# EasyEDA Pro project Motor.eprj

# Schematic Schematic1
Board Name: Board1; Create Date: 2025-05-12; Page Name: P1; Project Name: Motor; Schematic Name: Schematic1; Update Date: 2025-05-25; Company: 嘉立创EDA; Page Size: A4; Version: V1.0
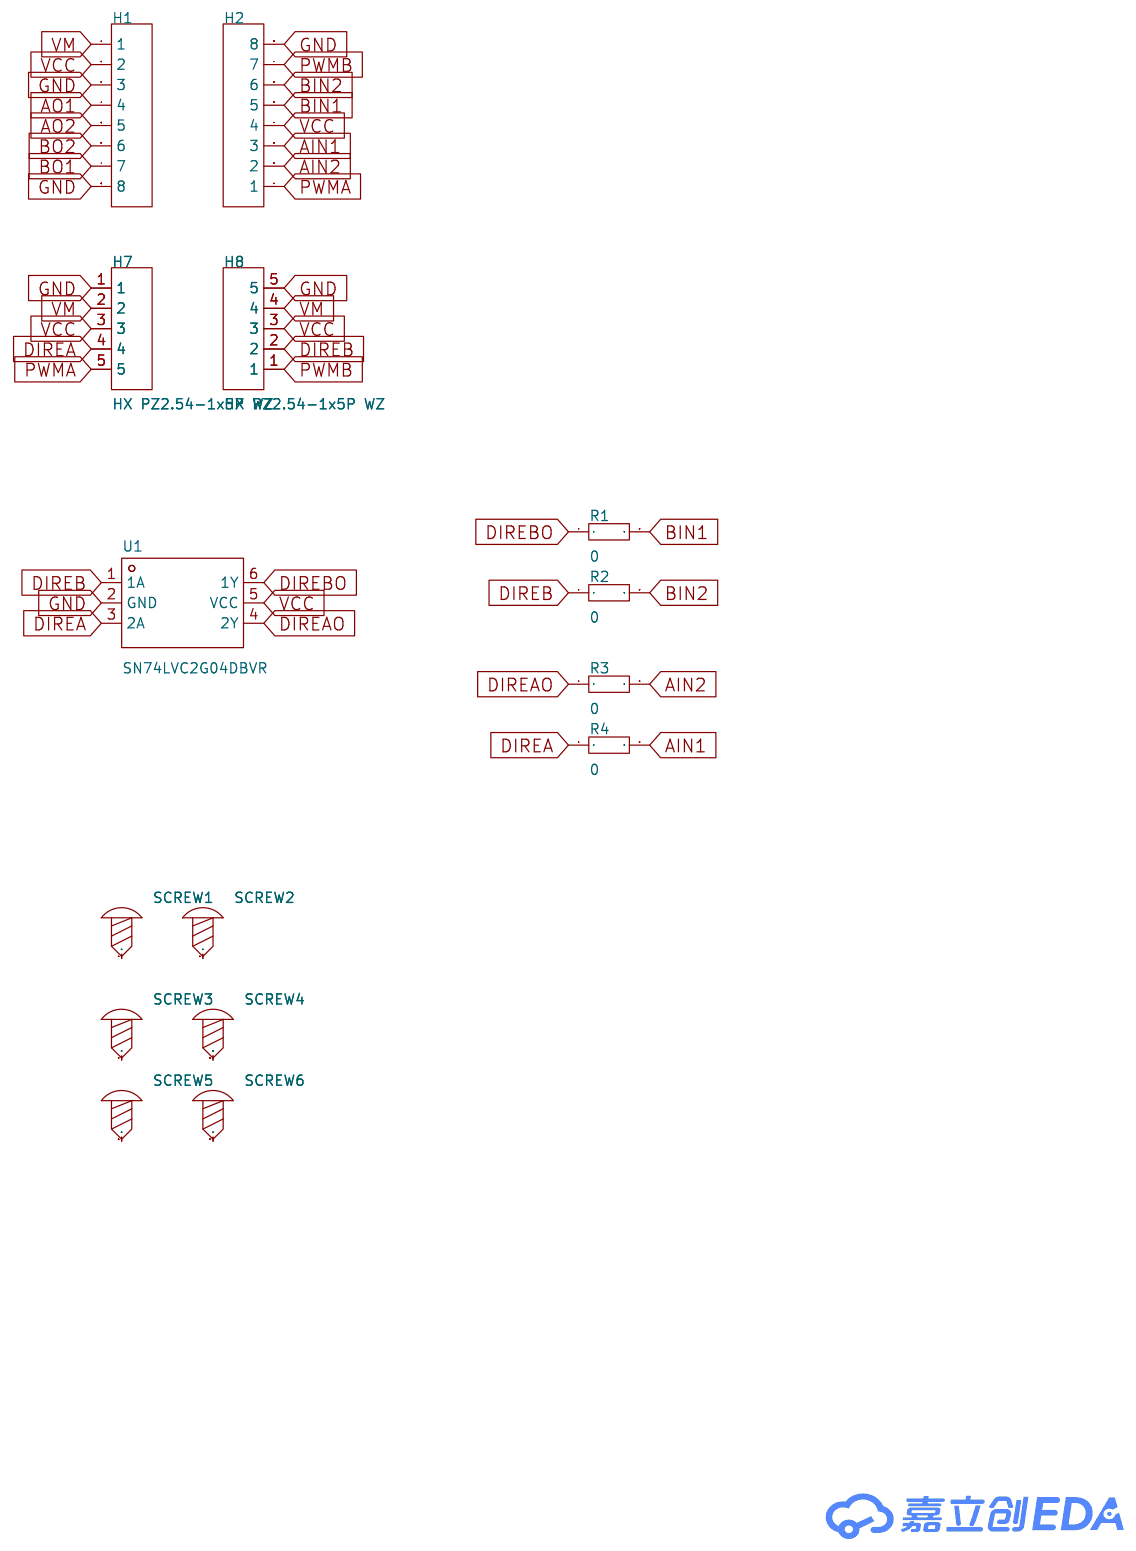
[diagram p0: schematic sheet]

## Parts
H1  -  [HDR-TH_8P-P2.54-V-F-1]
H2  -  [HDR-TH_8P-P2.54-V-F-1]
H7  HX PZ2.54-1x5P WZ  [HDR-TH_5P-P2.54-H-M-W10.0-N]
H8  HX PZ2.54-1x5P WZ  [HDR-TH_5P-P2.54-H-M-W10.0-N]
R1  0  [R0805]
R2  0  [R0805]
R3  0  [R0805]
R4  0  [R0805]
SCREW1  -  [M3螺丝]
SCREW2  -  [M3螺丝]
SCREW3  -  [M2螺丝]
SCREW4  -  [M2螺丝]
SCREW5  -  [M2螺丝]
SCREW6  -  [M2螺丝]
U1  SN74LVC2G04DBVR  [SOT-23-6_L2.9-W1.6-P0.95-LS2.8-BR]

## Library data of the parts
H1 H2 = HDR-F_2.54_1x8P: Supplier Part: C27438; Supplier Footprint: 插件
H7 H8 = HX PZ2.54-1x5P WZ: LCSC Part Name: 1x5P 间距:2.54mm 方针 弯插; Supplier Part: C32713264; Manufacturer: hanxia(韩下); Supplier Footprint: 弯插,P=2.54mm; Datasheet: https://atta.szlcsc.com/upload/public/pdf/source/20240723/1F79D9A8CAFAE1F1D766CA38C1092C29.pdf; Supplier: LCSC; Pin Structure: 1x5P; Pitch: 2.54mm; Circluar Pins/Square Pins: 方针; Mounting Type: 弯插; Number of Rows: 单排; Number of Pins: 5P; Current Rating: 3A; Length of Mating Pin: 6mm; Insulation Height: 2.5mm; Length of End Connection Pin: 3mm; Contact Material: 黄铜; Contact Plating: 金; Operating Temperature: -40℃~+105℃; Color: 黑色
R1-R4 = Res_0805: Supplier Footprint: 0805
SCREW1 SCREW2 = M3螺丝: Supplier Footprint: 插件
SCREW3-SCREW6 = M2螺丝: Supplier Footprint: 插件
U1 = SN74LVC2G04DBVR: LCSC Part Name: 双路反相器; Supplier Part: C10428; Manufacturer: TI(德州仪器); Supplier Footprint: SOT-23-6; JLCPCB Part Class: 扩展库; Datasheet: https://www.ti.com/cn/lit/gpn/sn74lvc2g04; Supplier: LCSC; Voltage - Supply: 1.65V~5.5V; Current - Supply: 10uA; Number of Circuits: 2; Number of Inputs: 2; Current - Output Low(IOL): 32mA; Current - Output High(IOH): 32mA; Input Logic Level - High: 1.7V~2V; Input Logic Level -Low: 700mV~800mV; Max Propagation Delay: 3.2ns@5V,50pF; Series: 74LVC系列

## Nets
GND: H1.3 H1.8 H2.8 H7.1 H8.5 U1.2(GND)
VCC: H1.2 H2.4 H7.3 H8.3 U1.5(VCC)
AIN1: H2.3 R4.2
AIN2: H2.2 R3.2
AO1: H1.4
AO2: H1.5
BIN1: H2.5 R1.2
BIN2: H2.6 R2.2
BO1: H1.7
BO2: H1.6
DIREA: H7.4 R4.1 U1.3(2A)
DIREAO: R3.1 U1.4(2Y)
DIREB: H8.2 R2.1 U1.1(1A)
DIREBO: R1.1 U1.6(1Y)
PWMA: H2.1 H7.5
PWMB: H2.7 H8.1
VM: H1.1 H7.2 H8.4

Not connected (* = marked no-connect by the designer): SCREW1 1; SCREW2 1; SCREW3 1; SCREW4 1; SCREW5 1; SCREW6 1

# Board PCB1
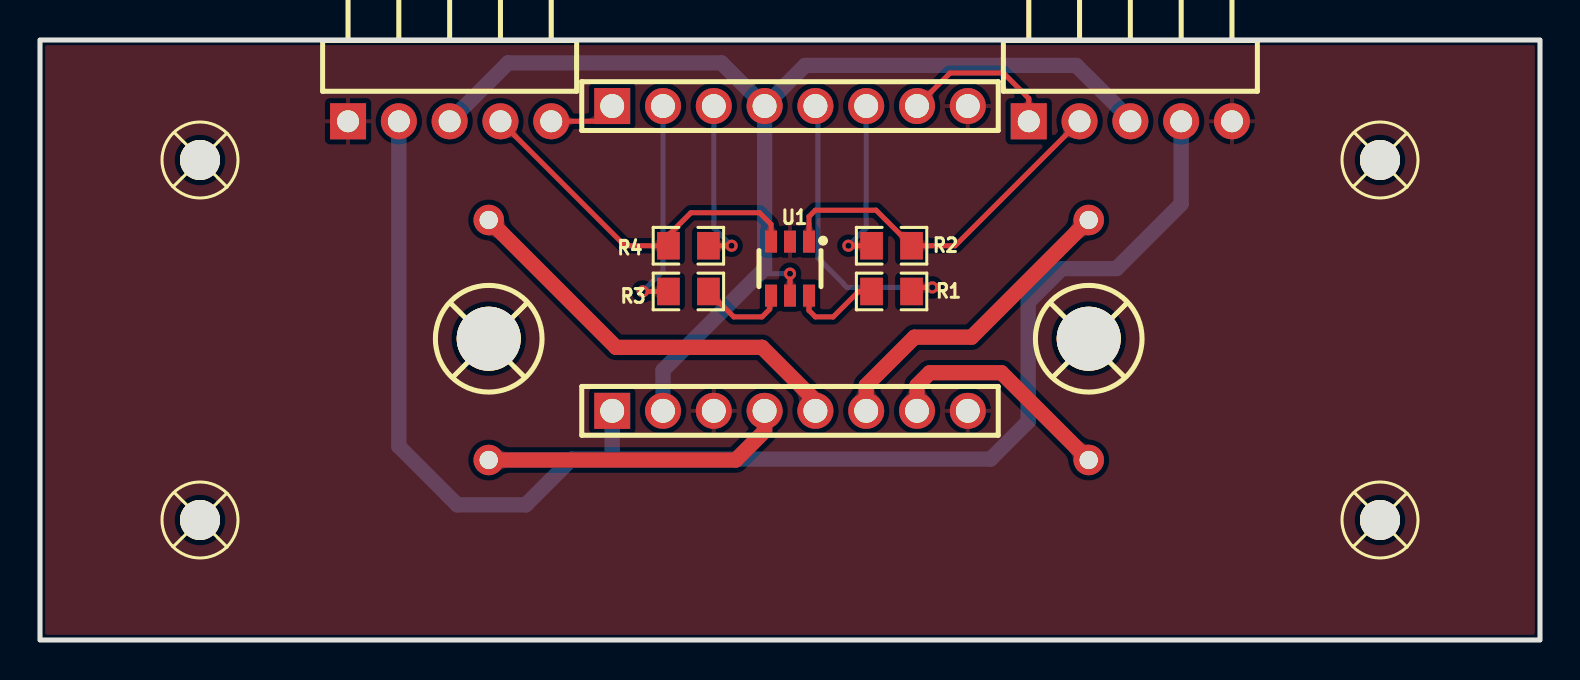
[diagram p1: board, top side]
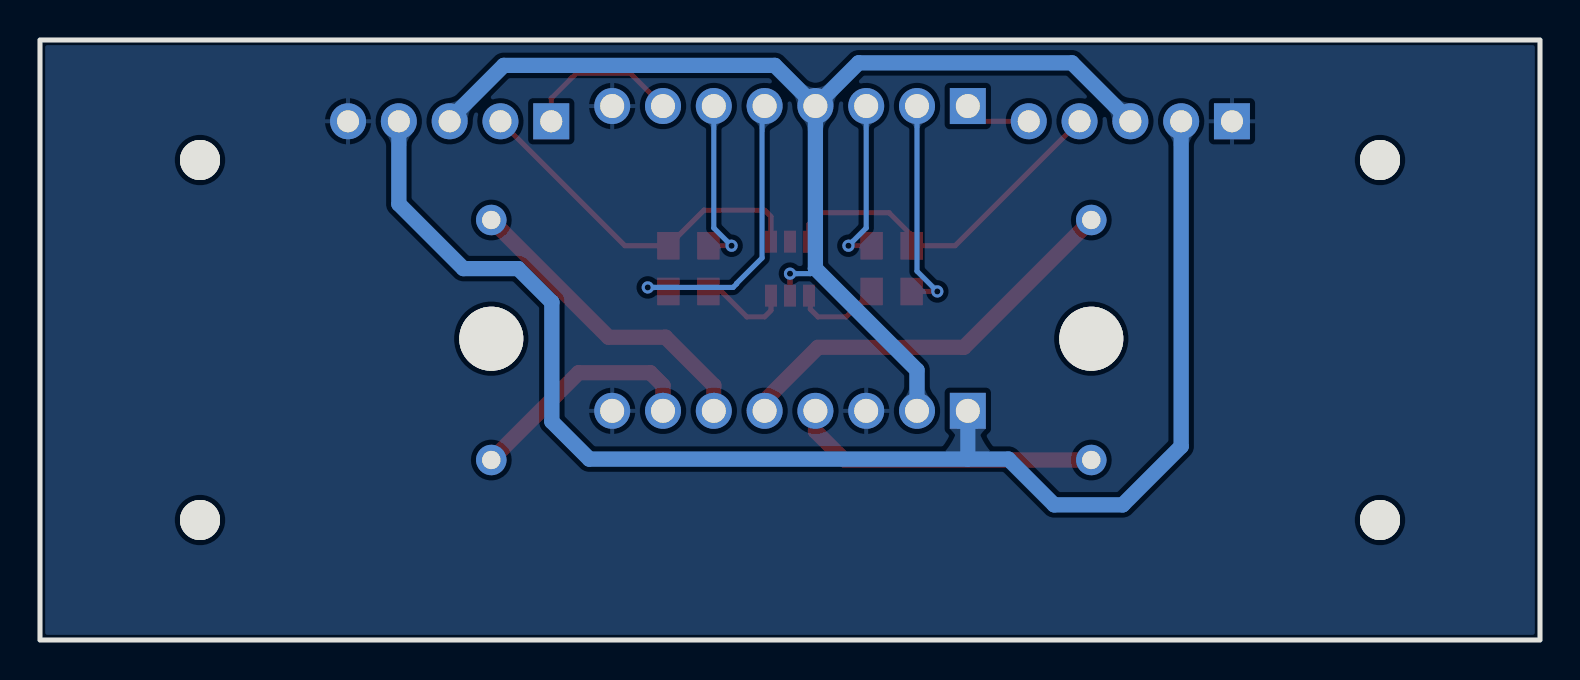
[diagram p2: board, bottom side, seen from below]

Outline 75 x 30 mm; copper layers: Top Layer, Bottom Layer. Coordinates in mm from the lower left corner of the outline.
Outline path: rectangle 0,30 75,0
Stack: Top Layer 0.035mm / Dielectric1 1.51mm FR4 er 4.5 / Bottom Layer 0.035mm

## Design rules (mm)
template: JLCPCB Capability(Two Layers Board)
spacing copperThickness1oz (default): track to track 0.102, other pairs 0.152 to 0.3
spacing copperThickness2oz: track to track 0.203, other pairs 0.152 to 0.3
track width copperThickness1oz (default): min 0.127, default 0.254, max 2.54
track width copperThickness2oz: min 0.203, default 0.254, max 2.54
differential pair differentialPair (default): width min 0.127, default 0.254, max 2.54; gap min 0.152, default 0.152
via viaSize (default): diameter min 0.5, default 0.61, max 10; hole min 0.3, default 0.305, max 6.3

## Placement (name value [footprint] x y rotation side)
H1  -  [HDR-TH_8P-P2.54-V-F-1]  37.5 11.46 0 top
H2  -  [HDR-TH_8P-P2.54-V-F-1]  37.5 26.7 0 top
H7  HX PZ2.54-1x5P WZ  [HDR-TH_5P-P2.54-H-M-W10.0-N]  20.48 25.94 0 top
H8  HX PZ2.54-1x5P WZ  [HDR-TH_5P-P2.54-H-M-W10.0-N]  54.52 25.94 0 top
NOREF  -  [Pad_e400]  22.44 21 90 top
NOREF#2  -  [Pad_e171]  52.44 21 90 top
NOREF#3  -  [Pad_e172]  52.44 9 90 top
NOREF#4  -  [Pad_e401]  22.44 9 90 top
R1  0  [R0805]  42.58 17.43 0 top
R2  0  [R0805]  42.58 19.71 180 top
R3  0  [R0805]  32.42 17.43 180 top
R4  0  [R0805]  32.42 19.71 0 top
SCREW1  -  [M3螺丝]  22.5 15 0 top
SCREW2  -  [M3螺丝]  52.5 15 0 top
SCREW3  -  [M2螺丝]  8 24 0 top
SCREW4  -  [M2螺丝]  8 6 0 top
SCREW5  -  [M2螺丝]  67 24 0 top
SCREW6  -  [M2螺丝]  67 6 0 top
U1  SN74LVC2G04DBVR  [SOT-23-6_L2.9-W1.6-P0.95-LS2.8-BR]  37.5 18.57 90 top

## Footprints (pads in the part's own frame, mm; a bottom-side part is the same pattern mirrored in y, then rotated)
HDR-TH_5P-P2.54-H-M-W10.0-N
  rect 1.8x1.8 hole 1.1: 1(-5.08,0)
  round 1.8 hole 1.1: 2(-2.54,0) 3(0,0) 4(2.54,0) 5(5.08,0)
HDR-TH_8P-P2.54-V-F-1
  rect 1.8x1.8 hole 1.2: 1(-8.89,0)
  round 1.8 hole 1.2: 2(-6.35,0) 3(-3.81,0) 4(-1.27,0) 5(1.27,0) 6(3.81,0) 7(6.35,0) 8(8.89,0)
M2螺丝
  round 2 hole 2: 1(0,0)
M3螺丝
  round 3.2 hole 3.2: 1(-0.064,0.064)
Pad_e171
  round 1.524 hole 0.914: 1(0,0)
Pad_e172
  round 1.524 hole 0.914: 2(0,0)
Pad_e400
  round 1.524 hole 0.914: 1(0,0)
Pad_e401
  round 1.524 hole 0.914: 1(0,0)
R0805
  rect 1.133x1.377 smd: 1(-1,0) 2(1,0)
SOT-23-6_L2.9-W1.6-P0.95-LS2.8-BR
  rect 1.1x0.6 smd: 1(1.35,-0.95) 2(1.35,0) 3(1.35,0.95) 4(-1.35,0.95) 5(-1.35,0) 6(-1.35,-0.95)

## Nets
GND: H1.3 H1.8 H2.8 H7.1 H8.5 U1.2
VCC: H1.2 H2.4 H7.3 H8.3 U1.5
AIN1: H2.3 R4.2
AIN2: H2.2 R3.2
AO1: H1.4 NOREF#4.1
AO2: H1.5 NOREF.1
BIN1: H2.5 R1.2
BIN2: H2.6 R2.2
BO1: H1.7 NOREF#3.2
BO2: H1.6 NOREF#2.1
DIREA: H7.4 R4.1 U1.3
DIREAO: R3.1 U1.4
DIREB: H8.2 R2.1 U1.1
DIREBO: R1.1 U1.6
PWMA: H2.1 H7.5
PWMB: H2.7 H8.1
VM: H1.1 H7.2 H8.4

Pads without a net: SCREW1 1; SCREW2 1; SCREW3 1; SCREW4 1; SCREW5 1; SCREW6 1

## Via types
v1: diameter 0.61, hole 0.305, Top Layer to Bottom Layer, 5 vias

## Routing (per net, layer and track width the routed paths; a pad name or vN(x,y) marks a point on that pad's centre or on a via; arc(x,y) is an arc through that point)
VCC: length 58
  Top Layer w0.254: U1.5 v1(37.5,18.32)
  Bottom Layer w0.254: v1(37.5,18.32) 36.48,18.32 36.23,18.57
  Bottom Layer w0.762: H7.3 23.4,28.86 34.07,28.86 H2.4 ; H8.3 54.52,26.02 51.81,28.73 38.26,28.73 H2.4 ; H2.4 36.23,18.57 31.15,13.49 H1.2
AIN1: length 8.5
  Top Layer w0.254: v1(34.58,19.71) R4.2
  Bottom Layer w0.254: H2.3 33.69,20.6 v1(34.58,19.71)
AIN2: length 11
  Top Layer w0.254: v1(30.13,17.43) R3.2
  Bottom Layer w0.254: H2.2 31.15,18.44 v1(30.13,17.43)
AO1: length 15.4
  Top Layer w0.762: NOREF#4.1 34.79,9 36.23,10.44 H1.4
AO2: length 20.6
  Top Layer w0.762: NOREF.1 28.8,14.63 36.1,14.63 38.77,11.97 H1.5
BIN1: length 15.1
  Top Layer w0.254: R1.2 43.78,17.63 v1(44.61,17.63)
  Bottom Layer w0.254: H2.5 38.9,26.57 38.9,19.1 40.17,17.83 40.17,17.81 40.35,17.63 v1(44.61,17.63)
BIN2: length 8.5
  Top Layer w0.254: v1(40.42,19.71) R2.2
  Bottom Layer w0.254: v1(40.42,19.71) 41.31,20.6 H2.6
BO1: length 11.9
  Top Layer w0.762: H1.7 43.85,12.73 44.49,13.36 48.07,13.36 NOREF#3.2
BO2: length 15.8
  Top Layer w0.762: NOREF#2.1 46.58,15.14 43.72,15.14 41.31,12.73 H1.6
DIREA: length 18.2
  Top Layer w0.254: H7.4 29.25,19.71 R4.1 31.42,20.24 32.55,21.36 35.98,21.36 36.55,20.79 U1.3
DIREAO: length 4.5
  Top Layer w0.254: R3.1 34.69,16.16 36.1,16.16 36.48,16.54 36.48,17.15 U1.4
DIREB: length 18.2
  Top Layer w0.254: U1.1 38.45,21.17 38.77,21.49 41.8,21.49 R2.1 45.75,19.71 H8.2
DIREBO: length 4.5
  Top Layer w0.254: R1.1 40.93,17.43 39.66,16.16 38.77,16.16 38.45,16.48 U1.6
PWMA: length 3.4
  Top Layer w0.254: H7.5 27.85,25.94 H2.1
PWMB: length 7.9
  Top Layer w0.254: H2.7 45.5,28.35 48.17,28.35 49.44,27.08 H8.1
VM: length 72.9
  Bottom Layer w0.762: H7.2 17.94,9.68 20.86,6.76 24.29,6.76 26.58,9.05 28.61,9.05 ; H1.1 28.61,9.05 ; 28.61,9.05 47.53,9.05 49.41,10.92 49.41,16.89 51.09,18.57 53.83,18.57 57.06,21.8 H8.4

## Copper pours and planes (outline as drawn; the poured copper is in the pictures)
GND on Top Layer: 0,30 75,30 75,0 0,0
GND on Bottom Layer: 0,30 75,30 75,0 0,0

Small or netless copper shapes (teardrops, artwork), in the pictures only: 34 on Top Layer, 19 on Bottom Layer
